# Altium schematic sheet ps.SchDoc: Power Supply
size OrCAD B; CheckedBy: liuchao; DrawnBy: liuchao; DocumentNumber: APEX-USB9; Revision: 3.0.0; SheetNumber: 9; SheetTotal: 9; PageSetup: Record=PageOptions|CenterHorizontal=True|CenterVertical=True|PrintScale=1.00|XCorrection=1.00|YCorrection=1.00|PrintKind=1|BorderSize=5000000|LeftOffset=0|BottomOffset=0|Orientation=2|PaperLength=2794|PaperWidth=2159|Scale=100|PaperSource=7|PrintQuality=600|MediaType=1|DitherType=10|PrintScaleMode=1|PaperKind=Letter (8.5" x 11")|PaperIndex=1
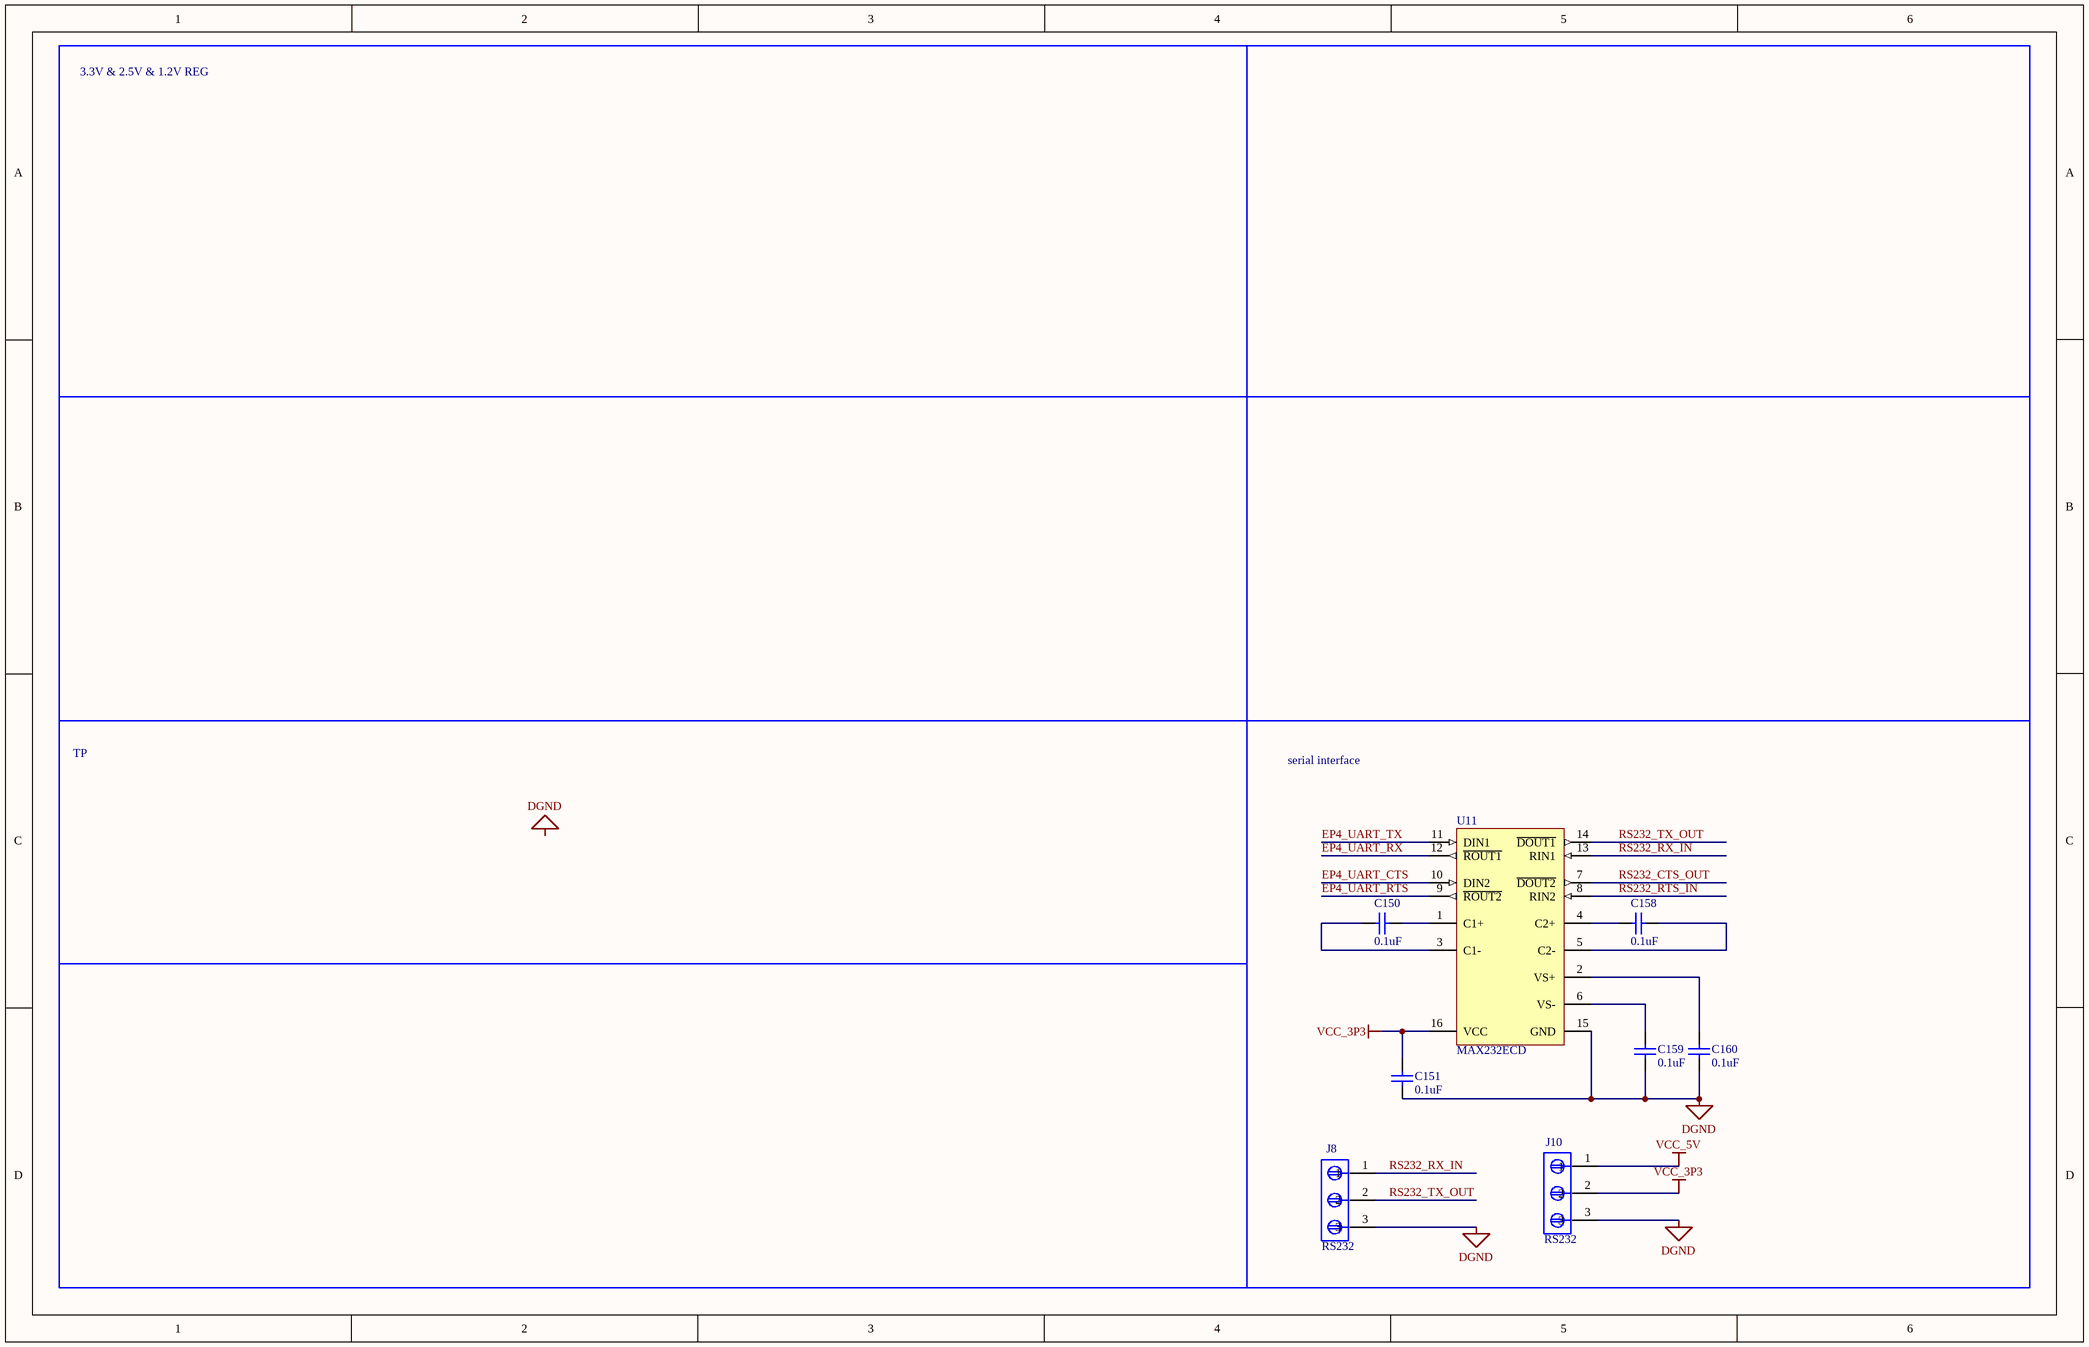
[diagram p0: ps.SchDoc]

## Parts
C150  value 0.1uF  [C_0402]  (hidden comment: Capacitor)
C151  value 0.1uF  [C_0402]  (hidden comment: Capacitor)
C158  value 0.1uF  [C_0402]  (hidden comment: Capacitor)
C159  value 0.1uF  [C_0402]  (hidden comment: Capacitor)
C160  value 0.1uF  [C_0402]  (hidden comment: Capacitor)
J8  value RS232  [CON3-2.54]  (hidden comment: DF3A-3P)
J10  value RS232  [CON3-2.54]  (hidden comment: DF3A-3P)
U11  MAX232ECD  [TI-D16_N]

## Nets
DGND: C151.2 C159.1 C160.2 J8.3 J10.3 U11.15(GND)
VCC_3P3: C151.1 J10.2 U11.16(VCC)
VCC_5V: J10.1
EP4_UART_CTS: U11.10(DIN2)
EP4_UART_RTS: U11.9(~{ROUT2})
EP4_UART_RX: U11.12(~{ROUT1})
EP4_UART_TX: U11.11(DIN1)
RS232_CTS_OUT: U11.7(~{DOUT2})
RS232_RTS_IN: U11.8(RIN2)
RS232_RX_IN: J8.1 U11.13(RIN1)
RS232_TX_OUT: J8.2 U11.14(~{DOUT1})
NetC150_1: C150.1 U11.3(C1-)
NetC150_2: C150.2 U11.1(C1+)
NetC158_1: C158.1 U11.5(C2-)
NetC158_2: C158.2 U11.4(C2+)
NetC159_2: C159.2 U11.6(VS-)
NetC160_1: C160.1 U11.2(VS+)

## Notes on the sheet
- 3.3V & 2.5V & 1.2V REG
- TP
- serial interface
- Labels drawn without touching a wire or pin: DGND

## Library data of the parts
C150 C151 C158-C160 = Cap Semi: Capacitor (Semiconductor SIM Model); Published: 8-Jun-2000; LatestRevisionDate: 29-May-2009; LatestRevisionNote: IPC-7351 Footprint Added.; PackageReference: C1206; Publisher: Altium Limited; PackageDescription: Chip Capacitor
J8 J10 = TERMDF3A-3P: Manufacturer #1: Allied 515-0058; Cost: 0.95; PCB DECAL: DF3A-3P
U11 = MAX232ECD: Dual RS-232 Driver / Receiver with IEC61000-4-2 Protection, 0 to 70 degC, 16-Pin SOIC (D), Green (RoHS & no Sb/Br); Drivers Per Package: 2; Supply Voltage(s)(V): 5; ESD HBM(kV): +/-15; ICC(Max)(mA): 10; Single Supply: TRUE; DatasheetVersion: SLLS723B; PackageVersion: revM, Jun-2011; PackageReference: D16; PackageDescription: 16-Pin Plastic Small Outline Integrated Circuit, 9.9 x 3.9 mm, Pitch 1.27 mm Pitch; SubFamily: RS-232; Receivers Per Package: 2; RS-232: TRUE; IEC-61000-4-2 SUPPORT: TRUE; ComponentLink1Description: Manufacturer URL; ComponentLink1URL: www.ti.com; ComponentLink2Description: Datasheet; ComponentLink2URL: http://www.ti.com/general/docs/lit/getliterature.tsp?genericPartNumber=MAX232E&fileType=pdf; ComponentLink3Description: Package Specification; ComponentLink3URL: http://www.ti.com/litv/pdf/mpds178g